# Altium schematic sheet SensorSlot1.SchDoc: Titel
size A4; ApprovedBy: name; CompanyName: DCI Electronics bv; DrawnBy: KRS; Address1: Nijverheidsstraat 14; Address2: 4458 AV Eindewege; Address3: Phone: +31 (0)113 344880; DocumentNumber: 12; Revision: 1; SheetNumber: 12; SheetTotal: 14; PageSetup: Record=PageOptions|CenterHorizontal=True|CenterVertical=True|PrintScale=1.00|XCorrection=1.00|YCorrection=1.00|PrintKind=1|BorderSize=5000000|LeftOffset=0|BottomOffset=0|Orientation=2|PaperLength=1000|PaperWidth=1000|Scale=100|PaperSource=7|PrintQuality=-4|MediaType=1|DitherType=10|PaperKind=ISO_A4_(210.00_x_297.00_MM)|PrintScaleMode=1; SubTitle: SubTitel; ApprovedDate: 01-01-12
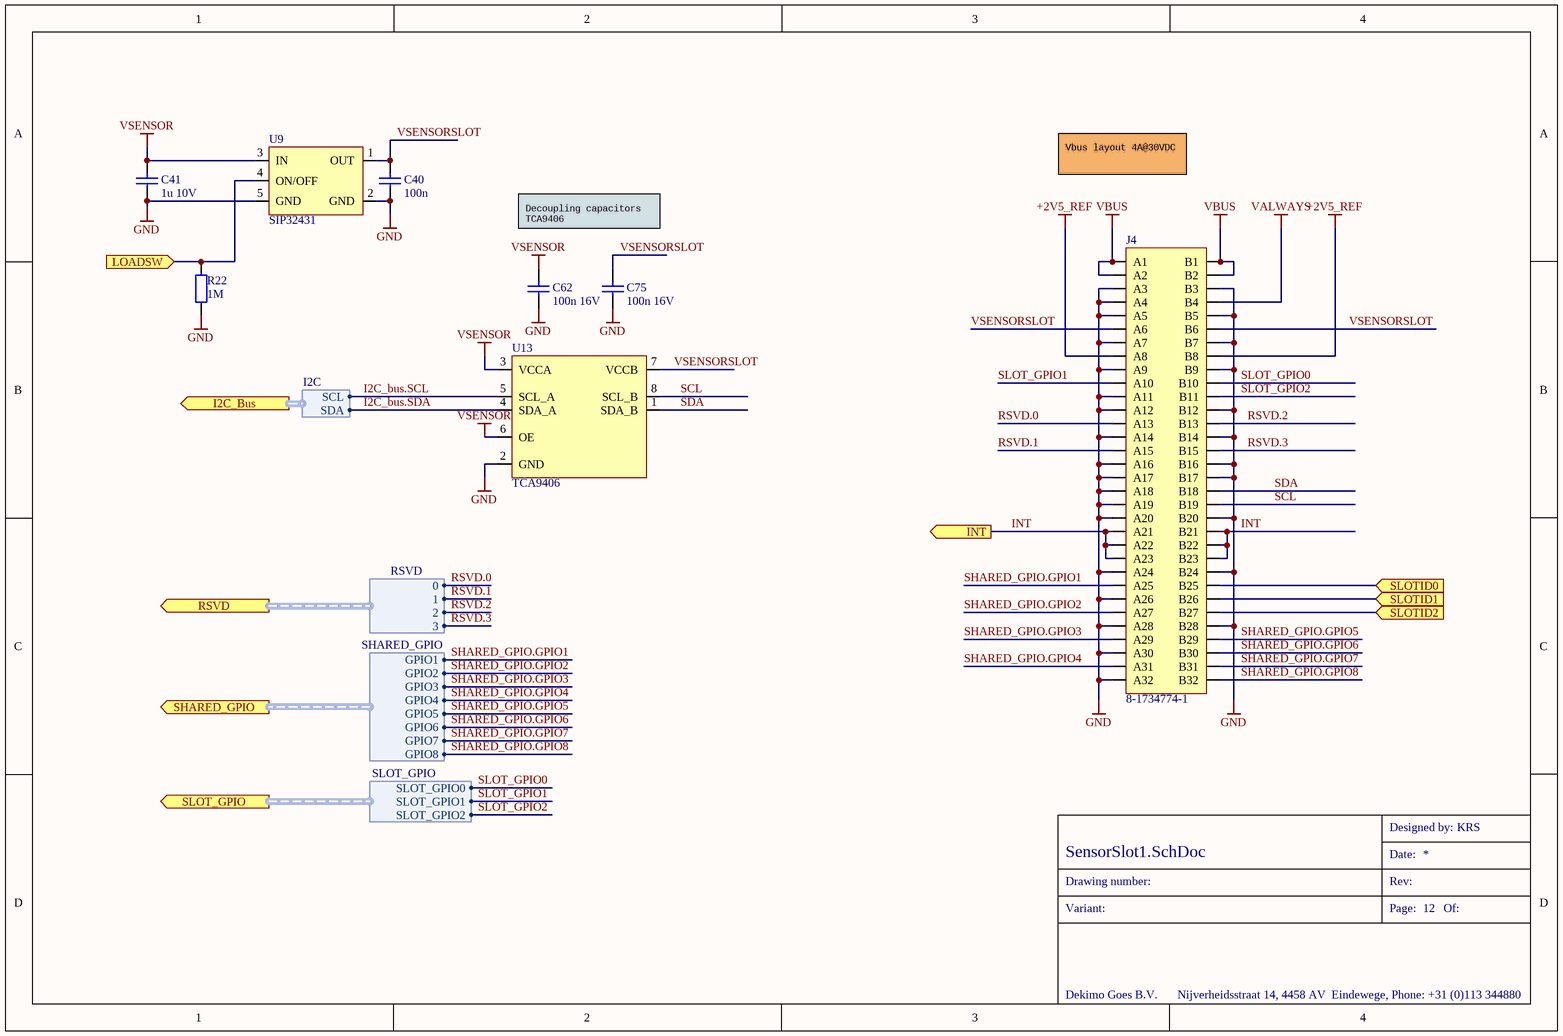
[diagram p0: SensorSlot1.SchDoc]

## Parts
C40  100n  [CAPC1608X09N]
C41  1u 10V  [CAPC1608X09N]
C62  100n 16V  [CAPC1005X05N]
C75  100n 16V  [CAPC1005X05N]
J4  8-1734774-1  [CON-601065-064]
R22  1M  [RESC1005x04N]
U9  SIP32431  [DFN-500001-004]
U13  TCA9406  [SOP-650002-008]

## Ports
I2C_Bus (out, harness I2C), INT (out), LOADSW (in), RSVD (out, harness RSVD), SHARED_GPIO (out, harness SHARED_GPIO), SLOT_GPIO (out, harness SLOT_GPIO), SLOTID0 (in), SLOTID1 (in), SLOTID2 (in)

## Harnesses
I2C: SCL, SDA
SLOT_GPIO: SLOT_GPIO0, SLOT_GPIO1, SLOT_GPIO2
SHARED_GPIO: GPIO1, GPIO2, GPIO3, GPIO4, GPIO5, GPIO6, GPIO7, GPIO8
RSVD: 0, 1, 2, 3

## Nets
+2V5_REF: J4.A8 J4.B8
GND: C40.1 C41.1 C62.1 C75.1 J4.A3 J4.A4 J4.A5 J4.A7 J4.A9 J4.A11 J4.A12 J4.A14 J4.A16 J4.A17 J4.A18 J4.A19 J4.A20 J4.A24 J4.A26 J4.A28 J4.A30 J4.A32 J4.B3 J4.B5 J4.B7 J4.B9 J4.B12 J4.B14 J4.B16 J4.B17 J4.B20 J4.B24 J4.B28 R22.1 U9.2(GND) U9.5(GND) U13.2(GND)
VALWAYS: J4.B4
VBUS: J4.A1 J4.A2 J4.B1 J4.B2
VSENSOR: C41.2 C62.2 U9.3(IN) U13.3(VCCA) U13.6(OE)
I2C_bus.SCL: U13.5(SCL_A) ; port I2C_Bus.SCL
I2C_bus.SDA: U13.4(SDA_A) ; port I2C_Bus.SDA
INT: J4.A21 J4.A22 J4.A23 J4.B21 J4.B22 J4.B23 ; port INT
LOADSW: R22.2 U9.4(ON/OFF) ; port LOADSW
RSVD.0: J4.A13 ; port RSVD.0
RSVD.1: J4.A15 ; port RSVD.1
RSVD.2: J4.B13 ; port RSVD.2
RSVD.3: J4.B15 ; port RSVD.3
SCL: J4.B19 U13.8(SCL_B)
SDA: J4.B18 U13.1(SDA_B)
SHARED_GPIO.GPIO1: J4.A25 ; port SHARED_GPIO.GPIO1
SHARED_GPIO.GPIO2: J4.A27 ; port SHARED_GPIO.GPIO2
SHARED_GPIO.GPIO3: J4.A29 ; port SHARED_GPIO.GPIO3
SHARED_GPIO.GPIO4: J4.A31 ; port SHARED_GPIO.GPIO4
SHARED_GPIO.GPIO5: J4.B29 ; port SHARED_GPIO.GPIO5
SHARED_GPIO.GPIO6: J4.B30 ; port SHARED_GPIO.GPIO6
SHARED_GPIO.GPIO7: J4.B31 ; port SHARED_GPIO.GPIO7
SHARED_GPIO.GPIO8: J4.B32 ; port SHARED_GPIO.GPIO8
SLOT_GPIO0: J4.B10 ; port SLOT_GPIO.SLOT_GPIO0
SLOT_GPIO1: J4.A10 ; port SLOT_GPIO.SLOT_GPIO1
SLOT_GPIO2: J4.B11 ; port SLOT_GPIO.SLOT_GPIO2
SLOTID0: J4.B25 ; port SLOTID0
SLOTID1: J4.B26 ; port SLOTID1
SLOTID2: J4.B27 ; port SLOTID2
VSENSORSLOT: C40.2 C75.2 J4.A6 J4.B6 U9.1(OUT) U13.7(VCCB)

## Notes on the sheet
- Vbus layout 4A@30VDC
- Decoupling capacitors
  TCA9406
- Designed by:
- Drawing number:
- Variant:
- Date:
- Page:
- Rev:
- Of:
- Dekimo Goes B.V.
- Nijverheidsstraat 14, 4458 AV  Eindewege, Phone: +31 (0)113 344880

## Library data of the parts
C40 = CKE 100N/60: 100nF 50V 10% X7R; EngPartGrpMainCode: CAP; ManufactpartCode: 2238 586 15649-PHI; Type: Capacitor ceramic SMD; Preferred: False; SMD_Flag: True; PartCode: CKE 100N/60
C41 = CKE 1U/60: 1UF, 10V, 10%, 0603, X5R; EngPartGrpMainCode: CAP; ManufactpartCode: 0603ZD105KAT2A-AVX; Type: Capacitor ceramic SMD; Preferred: False; SMD_Flag: True; PartCode: CKE 1U/60
C62 C75 = CKE 100N/70: 100nF, 16V, 10%, X7R; EngPartGrpMainCode: CAP; ManufactpartCode: CC0402KRX7R7BB104-YAG; Type: Capacitor ceramic SMD; Preferred: False; SMD_Flag: True; PartCode: CKE 100N/70
J4 = CON BTOB64S/1: PCIE x4 64pos; EngPartGrpMainCode: CONN; ManufactpartCode: 8-1734774-1-TEC; Preferred: False; PartCode: CON BTOB64S/1; Type: Connector various; SMD_Flag: False
R22 = R 1M/70: 1M, 62.5mW, 1%; PartCode: R 1M/70; EngPartGrpMainCode: RES; ManufactpartCode: RC0402FR-071ML-YAG; Preferred: False; SMD_Flag: True; Type: Resistor metalfilm SMD
U9 = IC SIP32431DN: load sw, 5.5V, 10pA Ishutdown; EngPartGrpMainCode: IC; ManufactpartCode: SIP32431DNP3-T1GE4-VIS; Preferred: False; SMD_Flag: True; PartCode: IC SIP32431DN; Type: IC switch SMD
U13 = IC TCA9406: I2C Level translator; EngPartGrpMainCode: IC; ManufactpartCode: TCA9406DCTR-TI; Preferred: False; SMD_Flag: True; PartCode: IC TCA9406; Type: IC driver SMD